# Altium schematic sheet Sheet1.SchDoc
size A4; SheetNumber: 1; SheetTotal: 2
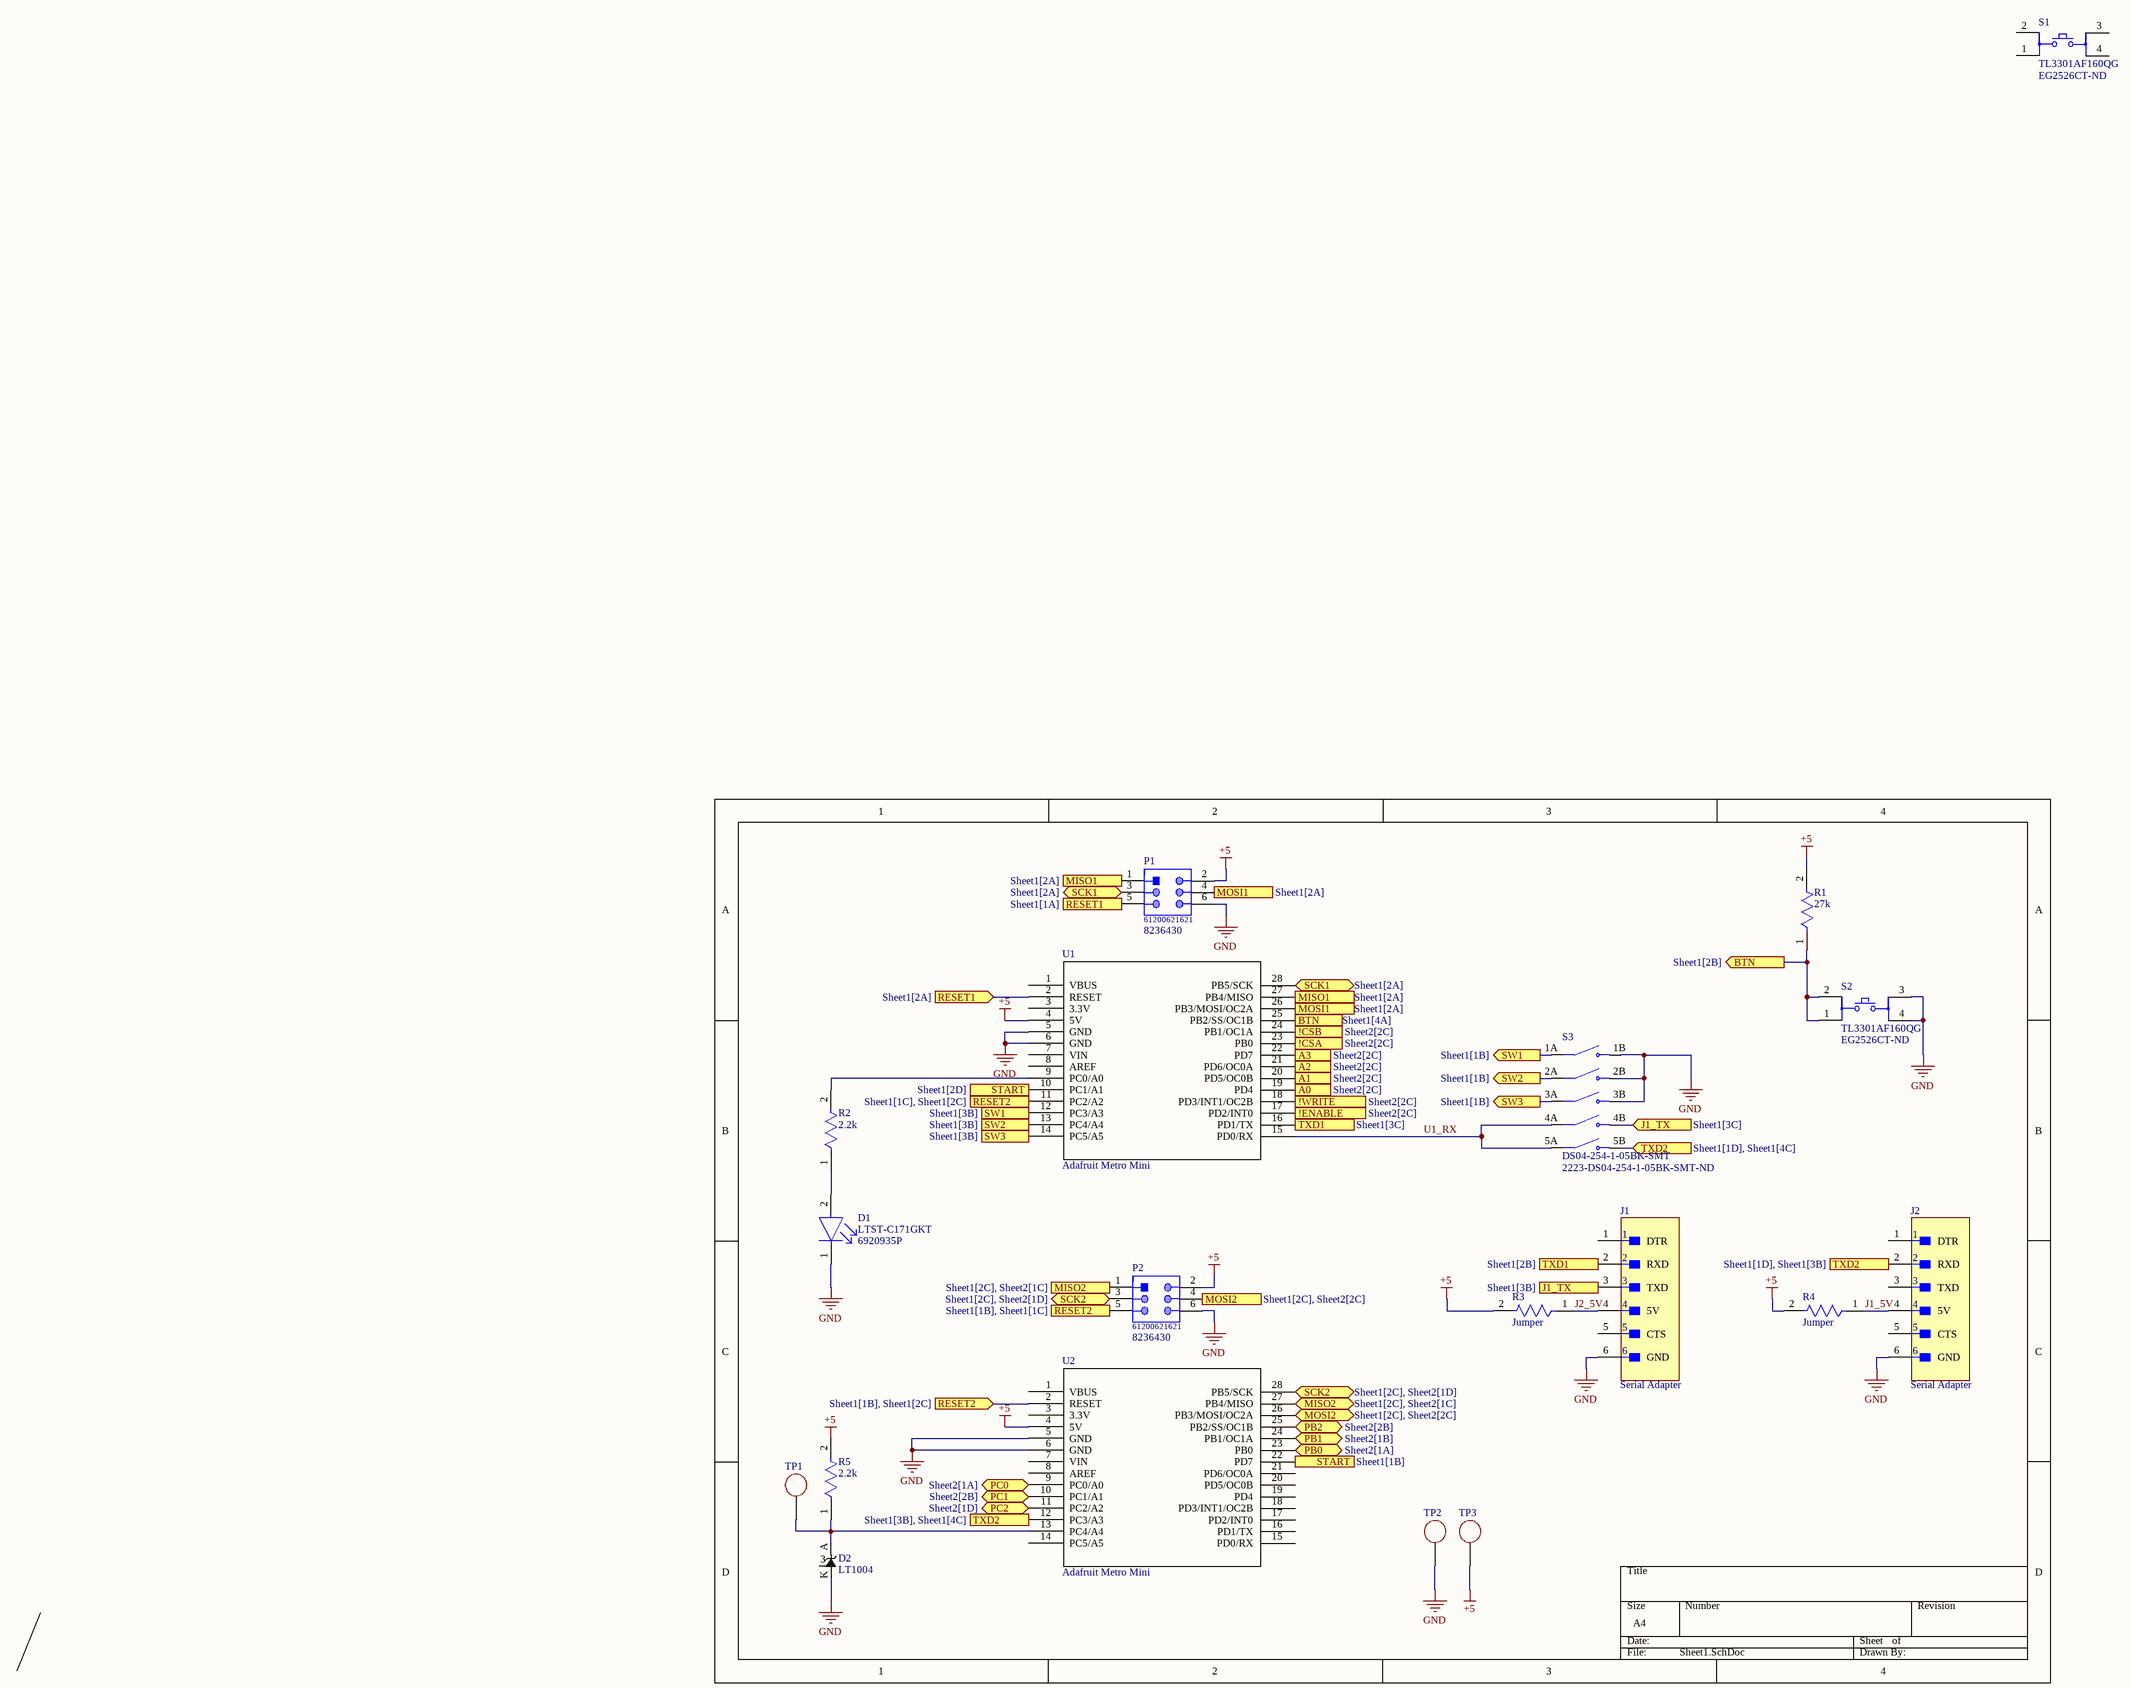
[diagram p0: Sheet1.SchDoc]

## Parts
D1  LTST-C171GKT  Supplier Part Number 1: 6920935P  [FP-LTST-C171GKT-MFG]
D2  LT1004  [LT1004CZ]  (no BOM)
J1  Serial Adapter  [FP-22-28-4060-MFG]
J2  Serial Adapter  [FP-22-28-4060-MFG]
P1  61200621621  Supplier Part Number 1: 8236430  [61200621621]
P2  61200621621  Supplier Part Number 1: 8236430  [61200621621]
R1  27k  [FP-RMCF0805-IPC_B]
R2  2.2k  [FP-RMCF0805-IPC_B]
R3  Jumper  [FP-RMCF0805-IPC_B]  (no BOM)
R4  Jumper  [FP-RMCF0805-IPC_B]  (no BOM)
R5  2.2k  [FP-RMCF0805-IPC_B]
S1  TL3301AF160QG  Supplier Part Number 1: EG2526CT-ND  [FP-TL3301AF160QG-MFG]
S2  TL3301AF160QG  Supplier Part Number 1: EG2526CT-ND  [FP-TL3301AF160QG-MFG]
S3  DS04-254-1-05BK-SMT  Supplier Part Number 1: 2223-DS04-254-1-05BK-SMT-ND  [SW_DS04-254-1-05BK-SMT]
TP1  61300111121  [61300111121]  (value not drawn)  (no BOM)
TP2  61300111121  [61300111121]  (value not drawn)  (no BOM)
TP3  61300111121  [61300111121]  (value not drawn)  (no BOM)
U1  Adafruit Metro Mini  [Adafruit Metro Mini]  (no BOM)
U2  Adafruit Metro Mini  [Adafruit Metro Mini]  (no BOM)

## Ports
!CSA (out, see Sheet2[2C]), !CSB (out, see Sheet2[2C]), !ENABLE (out, see Sheet2[2C]), !WRITE (out, see Sheet2[2C]), A0 (out, see Sheet2[2C]), A1 (out, see Sheet2[2C]), A2 (out, see Sheet2[2C]), A3 (out, see Sheet2[2C]), BTN (in, see Sheet1[4A]), BTN (out, see Sheet1[2B]), J1_TX (in, see Sheet1[3C]), J1_TX (out, see Sheet1[3B]), MISO1 (in, see Sheet1[2A]), MISO1 (out, see Sheet1[2A]), MISO2 (bidir, see Sheet1[2C], Sheet2[1C]), MISO2 (in, see Sheet1[2C], Sheet2[1C]), MOSI1 (in, see Sheet1[2A]), MOSI1 (out, see Sheet1[2A]), MOSI2 (bidir, see Sheet1[2C], Sheet2[2C]), MOSI2 (out, see Sheet1[2C], Sheet2[2C]), PB0 (bidir, see Sheet2[1A]), PB1 (bidir, see Sheet2[1B]), PB2 (bidir, see Sheet2[2B]), PC0 (bidir, see Sheet2[1A]), PC1 (bidir, see Sheet2[2B]), PC2 (bidir, see Sheet2[1D]), RESET1 (in, see Sheet1[2A]), RESET1 (out, see Sheet1[1A]), RESET2 (in, see Sheet1[1B], Sheet1[2C]), RESET2 (out, see Sheet1[1B], Sheet1[1C]), RESET2 (out, see Sheet1[1C], Sheet1[2C]), SCK1 (bidir, see Sheet1[2A]), SCK2 (bidir, see Sheet1[2C], Sheet2[1D]), START (in, see Sheet1[1B]), START (out, see Sheet1[2D]), SW1 (in, see Sheet1[3B]), SW1 (out, see Sheet1[1B]), SW2 (in, see Sheet1[3B]), SW2 (out, see Sheet1[1B]), SW3 (in, see Sheet1[3B]), SW3 (out, see Sheet1[1B]), TXD1 (in, see Sheet1[2B]), TXD1 (out, see Sheet1[3C]), TXD2 (in, see Sheet1[1D], Sheet1[3B]), TXD2 (in, see Sheet1[1D], Sheet1[4C]), TXD2 (out, see Sheet1[3B], Sheet1[4C])

## Nets
+5: P1.2(5V) P2.2(5V) R1.2 R3.2 R4.2 R5.2 TP3.1 U1.4(5V) U2.4(5V)
GND: D1.1(C) D2.K(Kathode) J1.6(GND) J2.6(GND) P1.6(GND) P2.6(GND) S2.3 S2.4 S3.1B(NO1) S3.2B(NO2) S3.3B(NO3) TP2.1 U1.5(GND) U1.6(GND) U2.5(GND) U2.6(GND)
!CSA: U1.23(PB0) ; port !CSA
!CSB: U1.24(PB1/OC1A) ; port !CSB
!ENABLE: U1.17(PD2/INT0) ; port !ENABLE
!WRITE: U1.18(PD3/INT1/OC2B) ; port !WRITE
A0: U1.19(PD4) ; port A0
A1: U1.20(PD5/OC0B) ; port A1
A2: U1.21(PD6/OC0A) ; port A2
A3: U1.22(PD7) ; port A3
BTN: R1.1 S2.1 S2.2 U1.25(PB2/SS/OC1B) ; port BTN
J1_5V: J2.4(5V) R4.1
J1_TX: J1.3(TXD) S3.4B(NO4) ; port J1_TX
J2_5V: J1.4(5V) R3.1
MISO1: P1.1(MISO) U1.27(PB4/MISO) ; port MISO1
MISO2: P2.1(MISO) U2.27(PB4/MISO) ; port MISO2
MOSI1: P1.4(MOSI) U1.26(PB3/MOSI/OC2A) ; port MOSI1
MOSI2: P2.4(MOSI) U2.26(PB3/MOSI/OC2A) ; port MOSI2
PB0: U2.23(PB0) ; port PB0
PB1: U2.24(PB1/OC1A) ; port PB1
PB2: U2.25(PB2/SS/OC1B) ; port PB2
PC0: U2.9(PC0/A0) ; port PC0
PC1: U2.10(PC1/A1) ; port PC1
PC2: U2.11(PC2/A2) ; port PC2
RESET1: P1.5(RESET) U1.2(RESET) ; port RESET1
RESET2: P2.5(RESET) U1.11(PC2/A2) U2.2(RESET) ; port RESET2
SCK1: P1.3(SCK) U1.28(PB5/SCK) ; port SCK1
SCK2: P2.3(SCK) U2.28(PB5/SCK) ; port SCK2
START: U1.10(PC1/A1) U2.22(PD7) ; port START
SW1: S3.1A(COM1) U1.12(PC3/A3) ; port SW1
SW2: S3.2A(COM2) U1.13(PC4/A4) ; port SW2
SW3: S3.3A(COM3) U1.14(PC5/A5) ; port SW3
TXD1: J1.2(RXD) U1.16(PD1/TX) ; port TXD1
TXD2: J2.2(RXD) S3.5B(NO5) U2.12(PC3/A3) ; port TXD2
U1_RX: S3.4A(COM4) S3.5A(COM5) U1.15(PD0/RX)
NetD1_2: D1.2(A) R2.1
NetD2_A: D2.A(Anode) R5.1 TP1.1 U2.13(PC4/A4)
NetR2_2: R2.2 U1.9(PC0/A0)

Not connected (* = marked no-connect by the designer): D2 3; J1 1(DTR) 5(CTS); J2 1(DTR) 3(TXD) 5(CTS); S1 1 2 3 4; U1 1(VBUS) 3(3.3V) 7(VIN) 8(AREF); U2 1(VBUS) 3(3.3V) 7(VIN) 8(AREF) 14(PC5/A5) 15(PD0/RX) 16(PD1/TX) 17(PD2/INT0) 18(PD3/INT1/OC2B) 19(PD4) 20(PD5/OC0B) 21(PD6/OC0A)

## Library data of the parts
D1 = CMP-22017-000007-1: LED GREEN CLEAR CHIP SMD; Luminous Intensity: 12mcd; Lens Color: Colorless; Dominant Wavelength: 569nm; Number of LEDs: 1; Power Dissipation: 100mW; Viewing Angle: 130°; Reverse Voltage: 5V; Test Current: 10mA; Forward Voltage: 2.1V; Wavelength: 585nm; Lens Style: Diffused; Forward Current: 30mA; Height: 0.8mm; Mount: Surface Mount; Package Quantity: 1; Length: 2mm; Case Code (Metric): 2012; Number of Pins: 2; Number of Elements: 1; Packaging: Tape and Reel; Color: Green; Min Operating Temperature: -55°C; Case/Package: 0805; Power Rating: 100mW; Max Operating Temperature: 85°C; Radiation Hardening: No; Depth: 1.25mm; Lens Transparency: Clear; Width: 1.25mm; Lead Free: Lead Free; Case Code (Imperial): 0805; Illumination Color: Green; Supplier 1: Rs
D2 = LT1004: pin to pad: 3>1 Â1>2
J1 J2 = CMP-04776-000763-1: CONN HEADER VERT 6POS 2.54MM; Voltage Rating: 250V; Current Rating: 4A; Number of Contacts: 6; Max Voltage Rating (DC): 250.25kV; Gender: Male; Contact Resistance: 20mR; Connector Type: Male Pin; Color: Black; Max Voltage Rating (AC): 250V; Pitch: 2.54mm; Orientation: Straight; Max Operating Temperature: 75°C; Contact Plating: Tin; Depth: 2.49mm; Contact Type: Male Pin; Number of Positions: 6; Length: 15.24mm; Packaging: Bulk; Mount: Through Hole; Housing Material: Thermoplastic; Housing Color: Black; Termination: Solder; Contact Material: Brass; Min Operating Temperature: 0°C; Series: KK® 42375; Number of Rows: 1; Package Quantity: 1; RoHS Compliant: Yes; Contact Mating Length: 0.24inch
P1 P2 = CMP-1502-00000-1: Male Box Header WR-BHD, THT, Vertical, pitch 2.54 mm, 6 pins; Manufacturer: Wurth Elektronik; Withstanding Voltage: 500VAC; Working Voltage: 250VAC; Pin Number: 6; Pitch: 2.54mm; Contact Resistance: 20mOhm; Part Number: 61200621621; Manufacturer URL: http://www.we-online.de; Published Date: August2018; Orientation: Vertical; Publisher: WurthElektronik; Operating Temperature: -40to125degC; Datasheet URL: https://katalog.we-online.de/em/datasheet/6120xx21621.pdf; Mounting Technology: THT; Packaging: Tray; Gender: Male; Package Reference: 61200621621; Supplier 1: Rs
R1-R5 = CMP-26527-000017-1: RES 0 OHM JUMPER 1/8W 0805; Power Rating: 125mW; Resistance: 0mR; Depth: 1.25mm; Length: 2mm; Military Standard: Not; Width: 0.049inch; Case Code (Imperial): 0805; Number of Terminations: 2; Mount: Surface Mount; Contact Plating: Tin; Height: 0.026inch; Case/Package: 0805; Min Operating Temperature: -55°C; Composition: Thick Film; Max Operating Temperature: 155°C; Packaging: Tape and Reel; Features: Automotive AEC-Q200; Max Power Dissipation: 125mW; Radiation Hardening: No; Lead Free: Lead Free; Case Code (Metric): 2012
S1 S2 = TL3301AF160QG: Keypad Switch, 1 Switches, SPST, Momentary-tactile, 0.05A, 50VDC, 2.06N, Solder Terminal, Surface Mount-straight12V; Actuator Type: Standard; Current Rating: 50mA; Contact Resistance: 100mR; Max Voltage Rating (DC): 50V; Voltage Rating (DC): 12V; Actuator Length: 1.4mm; Electrical Life: 100000Cycles; Switch Travel: 0.25mm; Operating Force: 160gf; Switch Function: Off-Mom; Actuator Material: Nylon; Illumination Type: Non-Illuminated; Orientation: Straight; Lead Free: Lead Free; Contact Material: Silver; Series: TL3301; Mount: Surface Mount; Voltage Rating: 50V; REACH SVHC: No SVHC; Packaging: Tape and Reel; Termination: Gull Wing; RoHS Compliant: Yes; Throw Configuration: SPST; Min Operating Temperature: -20°C; Package Quantity: 1000; Mechanical Life: 100000Cycles; Contact Plating: Silver; Max Operating Temperature: 70°C; Insulation Resistance: 100MR; Supplier 1: Digi-Key
TP1-TP3 = Testpoint: THT Vertical Pin Header WR-PHD, Pitch 2.54 mm, Single Row, 1 pins; Manufacturer: Wurth Elektronik; Gender: Male; Working Voltage: 250VAC; Withstanding Voltage: 500VAC; Pin Number: 1; Contact Resistance: 20mOhm; Rated Current: 3A; Pitch: 2.54mm; Mounting Technology: THT; Datasheet URL: https://katalog.we-online.de/em/datasheet/6130xx11121.pdf; Manufacturer URL: http://www.we-online.de; Operating Temperature: -40to105degC; Publisher: WurthElektronik; Part Number: 61300111121; Row Number: Single; Package Reference: 61300111121; Orientation: Vertical; Packaging: Bag
S3 = DS04-254-1-05BK-SMT: Availability: Unavailable; Price: None; Package: None; Value: *; MP: DS04-254-1-05BK-SMT; Supplier 1: Digi-Key